# EAGLE design motor (EAGLE 9.6.2)

## Sheet 1 of 2: MOTOR_DRIVER
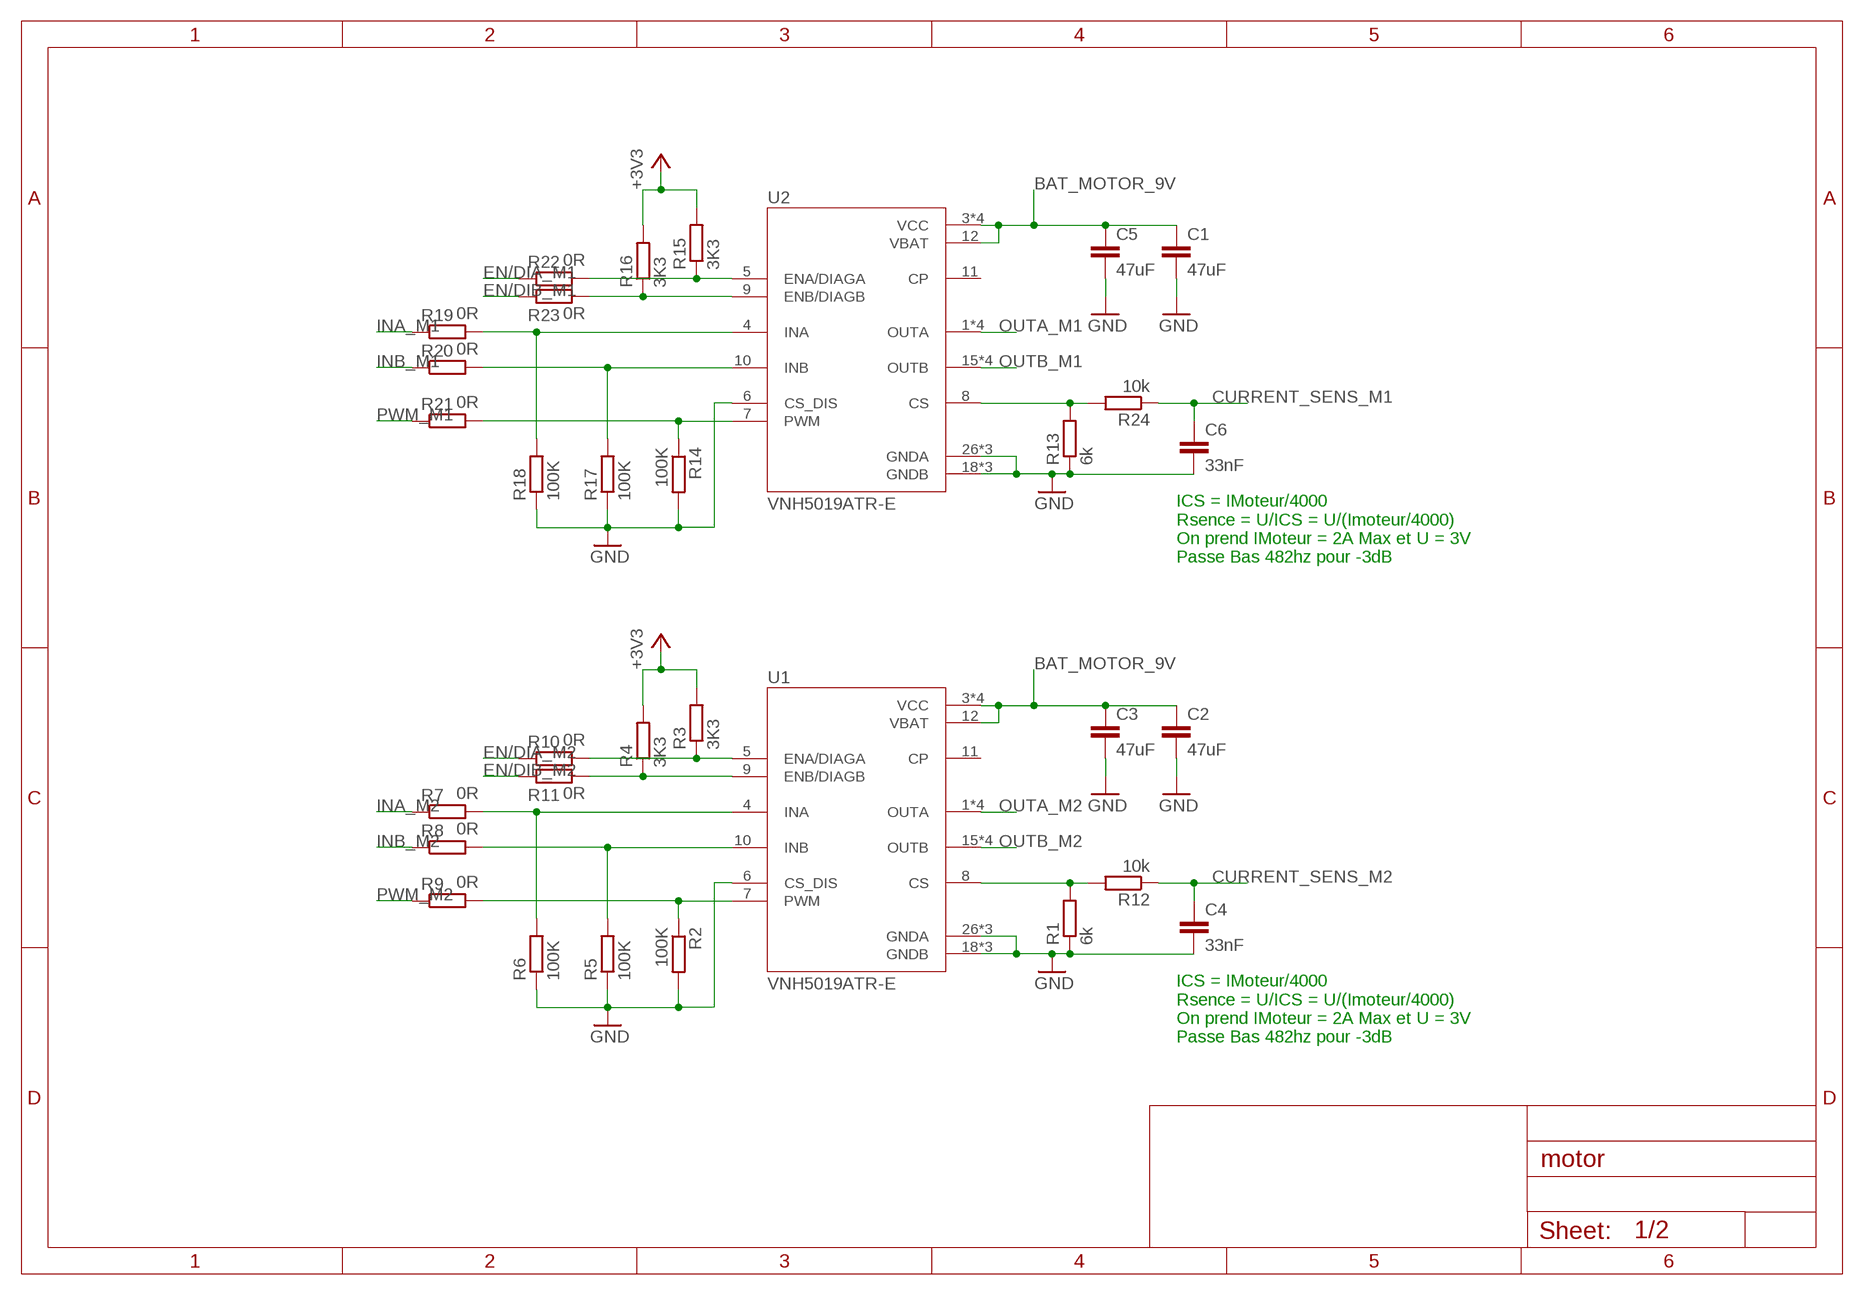
[diagram p0: schematic, sheet 1]

### Parts
C1  47uF  C-EUC0805  [C0805]
C2  47uF  C-EUC0805  [C0805]
C3  47uF  C-EUC0805  [C0805]
C4  33nF  C-EUC0805  [C0805]
C5  47uF  C-EUC0805  [C0805]
C6  33nF  C-EUC0805  [C0805]
R1  6k  R-EU_R0603  [R0603]
R2  100K  R-EU_R0603  [R0603]
R3  3K3  R-EU_R0603  [R0603]
R4  3K3  R-EU_R0603  [R0603]
R5  100K  R-EU_R0603  [R0603]
R6  100K  R-EU_R0603  [R0603]
R7  0R  R-EU_R0603  [R0603]
R8  0R  R-EU_R0603  [R0603]
R9  0R  R-EU_R0603  [R0603]
R10  0R  R-EU_R0603  [R0603]
R11  0R  R-EU_R0603  [R0603]
R12  10k  R-EU_R0603  [R0603]
R13  6k  R-EU_R0603  [R0603]
R14  100K  R-EU_R0603  [R0603]
R15  3K3  R-EU_R0603  [R0603]
R16  3K3  R-EU_R0603  [R0603]
R17  100K  R-EU_R0603  [R0603]
R18  100K  R-EU_R0603  [R0603]
R19  0R  R-EU_R0603  [R0603]
R20  0R  R-EU_R0603  [R0603]
R21  0R  R-EU_R0603  [R0603]
R22  0R  R-EU_R0603  [R0603]
R23  0R  R-EU_R0603  [R0603]
R24  10k  R-EU_R0603  [R0603]
U1  VNH5019ATR-E  [IC_VNH5019ATR-E]
U2  VNH5019ATR-E  [IC_VNH5019ATR-E]

### Nets
+3V3 [Power]: R3.2 R4.2 R15.2 R16.2 ; also sheet 2
BAT_MOTOR_9V [Motor]: C1.1 C2.1 C3.1 C5.1 U1.3(VCC) U1.12(VBAT) U1.13(VCC) U1.23(VCC) U1.HS1(VCC) U2.3(VCC) U2.12(VBAT) U2.13(VCC) U2.23(VCC) U2.HS1(VCC) ; also sheet 2
CURRENT_SENS_M1: C6.1 R24.1 ; also sheet 2
CURRENT_SENS_M2: C4.1 R12.1 ; also sheet 2
EN/DIA_M1: R22.1 ; also sheet 2
EN/DIA_M2: R10.1 ; also sheet 2
EN/DIB_M1: R23.1 ; also sheet 2
EN/DIB_M2: R11.1 ; also sheet 2
GND: C1.2 C2.2 C3.2 C4.2 C5.2 C6.2 R1.1 R2.2 R5.1 R6.1 R13.1 R14.2 R17.1 R18.1 U1.6(CS_DIS) U1.18(GNDB) U1.19(GNDB) U1.20(GNDB) U1.26(GNDA) U1.27(GNDA) U1.28(GNDA) U2.6(CS_DIS) U2.18(GNDB) U2.19(GNDB) U2.20(GNDB) U2.26(GNDA) U2.27(GNDA) U2.28(GNDA) ; also sheet 2
INA_M1: R19.1 ; also sheet 2
INA_M2: R7.1 ; also sheet 2
INB_M1: R20.1 ; also sheet 2
INB_M2: R8.1 ; also sheet 2
N$23: R1.2 R12.2 U1.8(CS)
N$24: R3.1 R10.2 U1.5(ENA/DIAGA)
N$25: R4.1 R11.2 U1.9(ENB/DIAGB)
N$26: R2.1 R9.2 U1.7(PWM)
N$27: R5.2 R8.2 U1.10(INB)
N$28: R6.2 R7.2 U1.4(INA)
N$29: R13.2 R24.2 U2.8(CS)
N$30: R15.1 R22.2 U2.5(ENA/DIAGA)
N$31: R16.1 R23.2 U2.9(ENB/DIAGB)
N$32: R14.1 R21.2 U2.7(PWM)
N$33: R17.2 R20.2 U2.10(INB)
N$34: R18.2 R19.2 U2.4(INA)
OUTA_M1 [Motor]: U2.1(OUTA) U2.25(OUTA) U2.30(OUTA) U2.HS2(OUTA) ; also sheet 2
OUTA_M2 [Motor]: U1.1(OUTA) U1.25(OUTA) U1.30(OUTA) U1.HS2(OUTA) ; also sheet 2
OUTB_M1 [Motor]: U2.15(OUTB) U2.16(OUTB) U2.21(OUTB) U2.HS3(OUTB) ; also sheet 2
OUTB_M2 [Motor]: U1.15(OUTB) U1.16(OUTB) U1.21(OUTB) U1.HS3(OUTB) ; also sheet 2
PWM_M1: R21.1 ; also sheet 2
PWM_M2: R9.1 ; also sheet 2
Unconnected: U1.11(CP) U2.11(CP)

### Notes on the sheet
- ICS = IMoteur/4000
  Rsence = U/ICS = U/(Imoteur/4000)
  On prend IMoteur = 2A Max et U = 3V
  Passe Bas 482hz pour -3dB
- ICS = IMoteur/4000
  Rsence = U/ICS = U/(Imoteur/4000)
  On prend IMoteur = 2A Max et U = 3V
  Passe Bas 482hz pour -3dB

## Sheet 2 of 2: MOTOR_CONNECTOR
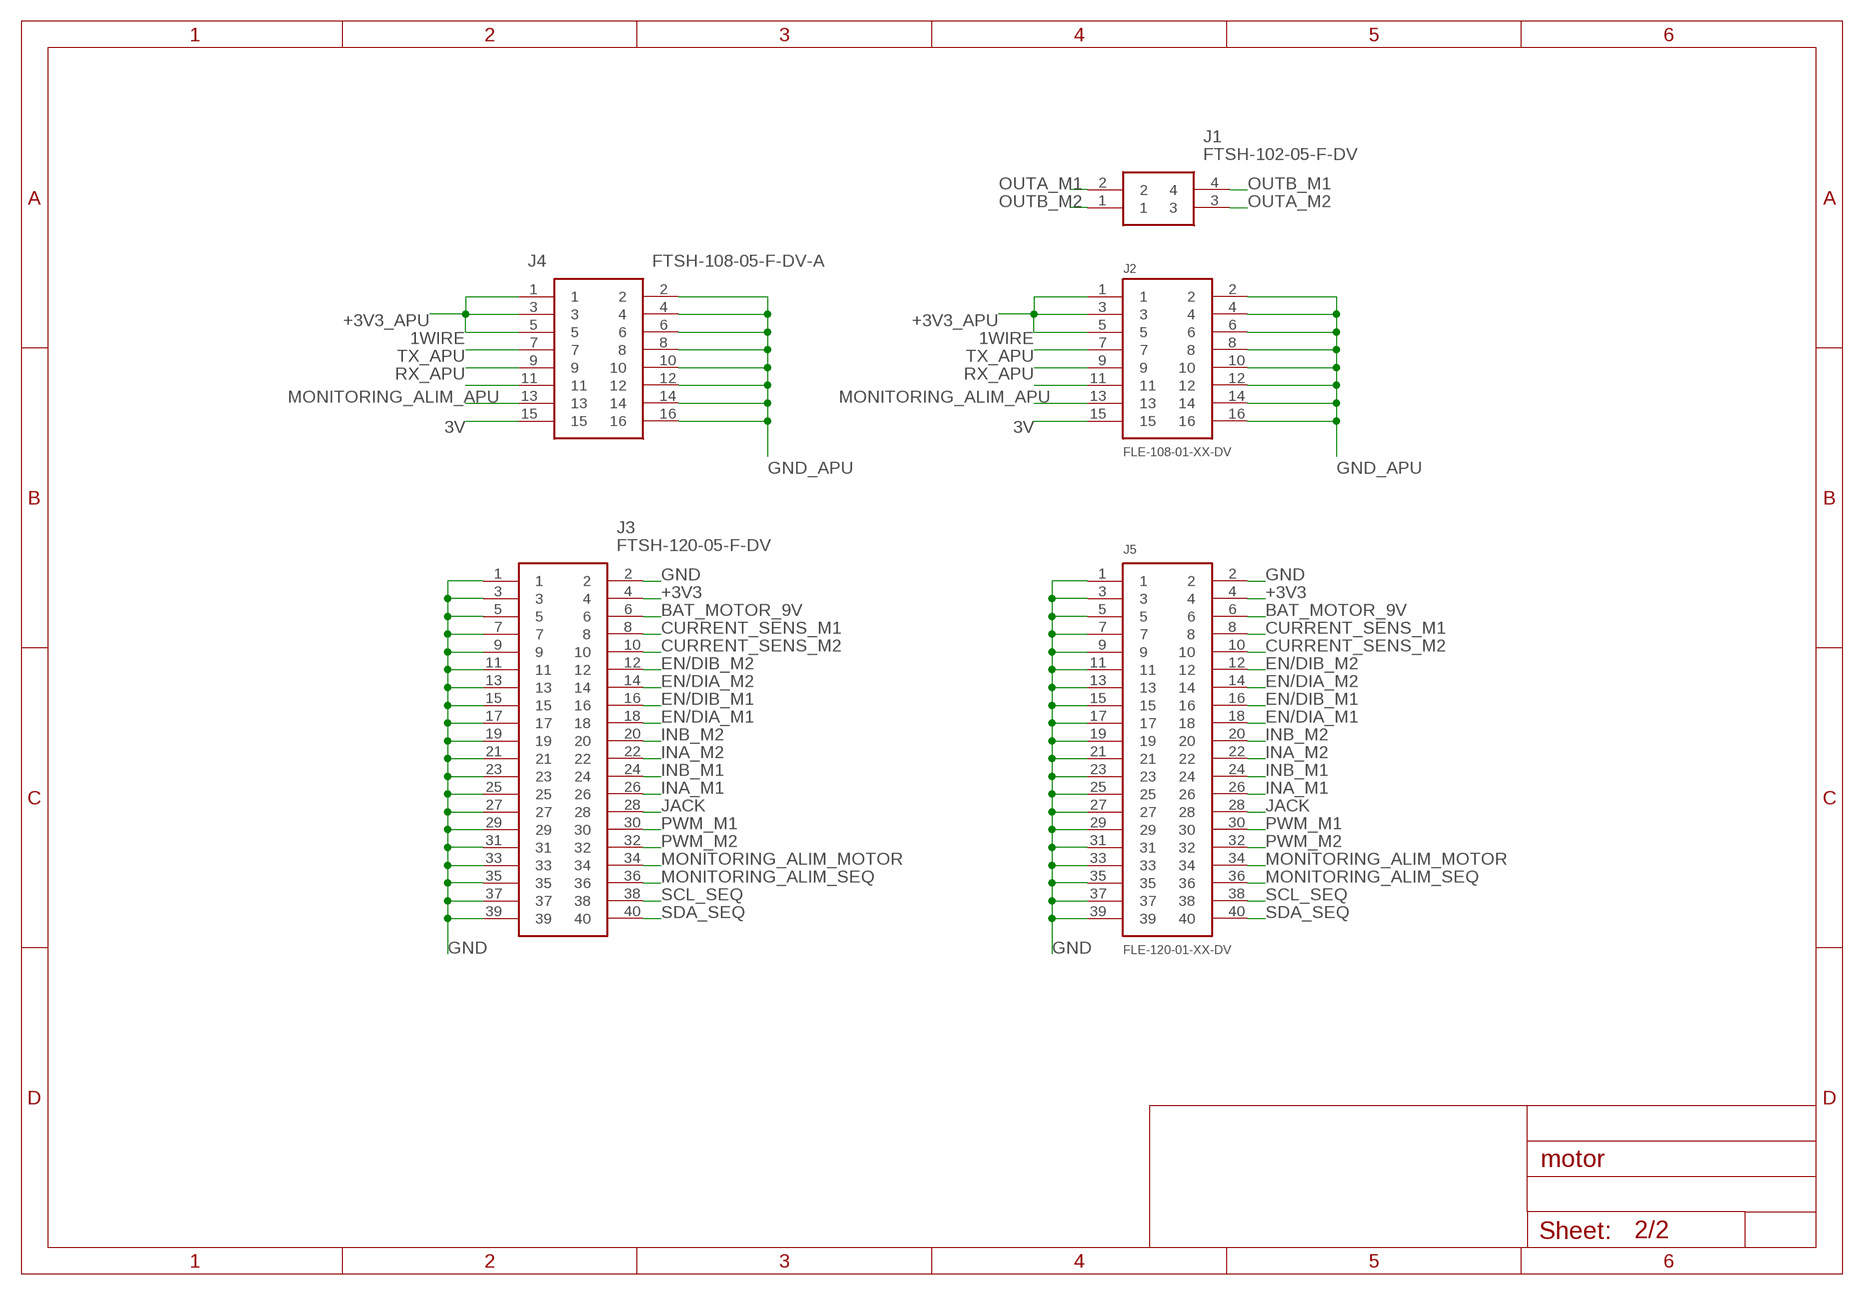
[diagram p1: schematic, sheet 2]

### Parts
J1  FTSH-102-05-F-DV  [FTSH-102-XX-YYY-DV]
J2  FLE-108-01-XX-DV  [FLE-108-01-XX-DV]
J3  FTSH-120-05-F-DV  [FTSH-120-XX-YYY-DV]
J4  FTSH-108-05-F-DV-A  [FTSH-108-XX-YYY-DV-A]
J5  FLE-120-01-XX-DV  [FLE-120-01-XX-DV]

### Nets
1WIRE [50Ohms]: J2.7 J4.7
3V [Power]: J2.15 J4.15
+3V3 [Power]: J3.4 J5.4 ; also sheet 1
+3V3_APU [Power]: J2.1 J2.3 J2.5 J4.1 J4.3 J4.5
BAT_MOTOR_9V [Motor]: J3.6 J5.6 ; also sheet 1
CURRENT_SENS_M1: J3.8 J5.8 ; also sheet 1
CURRENT_SENS_M2: J3.10 J5.10 ; also sheet 1
EN/DIA_M1: J3.18 J5.18 ; also sheet 1
EN/DIA_M2: J3.14 J5.14 ; also sheet 1
EN/DIB_M1: J3.16 J5.16 ; also sheet 1
EN/DIB_M2: J3.12 J5.12 ; also sheet 1
GND: J3.1 J3.2 J3.3 J3.5 J3.7 J3.9 J3.11 J3.13 J3.15 J3.17 J3.19 J3.21 J3.23 J3.25 J3.27 J3.29 J3.31 J3.33 J3.35 J3.37 J3.39 J5.1 J5.2 J5.3 J5.5 J5.7 J5.9 J5.11 J5.13 J5.15 J5.17 J5.19 J5.21 J5.23 J5.25 J5.27 J5.29 J5.31 J5.33 J5.35 J5.37 J5.39 ; also sheet 1
GND_APU: J2.2 J2.4 J2.6 J2.8 J2.10 J2.12 J2.14 J2.16 J4.2 J4.4 J4.6 J4.8 J4.10 J4.12 J4.14 J4.16
INA_M1: J3.26 J5.26 ; also sheet 1
INA_M2: J3.22 J5.22 ; also sheet 1
INB_M1: J3.24 J5.24 ; also sheet 1
INB_M2: J3.20 J5.20 ; also sheet 1
JACK: J3.28 J5.28
MONITORING_ALIM_APU: J2.13 J4.13
MONITORING_ALIM_MOTOR: J3.34 J5.34
MONITORING_ALIM_SEQ: J3.36 J5.36
OUTA_M1 [Motor]: J1.2 ; also sheet 1
OUTA_M2 [Motor]: J1.3 ; also sheet 1
OUTB_M1 [Motor]: J1.4 ; also sheet 1
OUTB_M2 [Motor]: J1.1 ; also sheet 1
PWM_M1: J3.30 J5.30 ; also sheet 1
PWM_M2: J3.32 J5.32 ; also sheet 1
RX_APU [50Ohms]: J2.11 J4.11
SCL_SEQ [50Ohms]: J3.38 J5.38
SDA_SEQ [50Ohms]: J3.40 J5.40
TX_APU [50Ohms]: J2.9 J4.9

## Library data of the parts
C1-C6 = rcl:C-EU: CAPACITOR, European symbol; SPICEPREFIX: C
J1 = FTSH-102-05-F-DV:FTSH-102-05-F-DV: 4 Position, High Reliability Header Strips, 0.050" pitch Source: Datasheet <http://suddendocs.samtec.com/prints/ftsh-1xx-xx-xxx-dv-xxx-xxx-mkt.pdf>; DESCRIPTION: 4 Position, High Reliability Header Strips, 0.050&quot; pitch; HEIGHT: mm; MANUFACTURER_NAME: SAMTEC; MANUFACTURER_PART_NUMBER: FTSH-102-05-F-DV
J2 = FLE-108-01-XX-DV:FLE-108-01-XX-DV: DOUBLE ROW 0.050"X0.050" STRIP ASSEMBLY. Check prices <https://pricing.snapeda.com/parts/FLE-108-01-G-DV/Samtec/view-part?ref=eda>; AVAILABILITY: Bad; DESCRIPTION: 16 Position Receptacle Connector Surface Mount; MF: Samtec; MP: FLE-108-01-G-DV; PACKAGE: None; PRICE: None; PURCHASE-URL: https://pricing.snapeda.com/search/part/FLE-108-01-G-DV/?ref=eda
J3 = FTSH-120-05-F-DV:FTSH-120-05-F-DV: 40 Position, High Reliability Header Strips, 0.050" pitch Source: Datasheet <http://suddendocs.samtec.com/prints/ftsh-1xx-xx-xxx-dv-xxx-xxx-mkt.pdf>; DESCRIPTION: 40 Position, High Reliability Header Strips, 0.050&quot; pitch; HEIGHT: mm; MANUFACTURER_NAME: SAMTEC; MANUFACTURER_PART_NUMBER: FTSH-120-05-F-DV
J4 = FTSH-108-05-F-DV-A:FTSH-108-05-F-DV-A: 16 Position, High Reliability Header Strips, 0.050" pitch Source: Datasheet <http://suddendocs.samtec.com/prints/ftsh-1xx-xx-xxx-dv-xxx-xxx-mkt.pdf>; ARROW_PART_NUMBER: FTSH-108-05-F-DV-A; ARROW_PRICE-STOCK: https://www.arrow.com/en/products/ftsh-108-05-f-dv-a/samtec; DESCRIPTION: 16 Position, High Reliability Header Strips, 0.050&quot; pitch; HEIGHT: mm; MANUFACTURER_NAME: SAMTEC; MANUFACTURER_PART_NUMBER: FTSH-108-05-F-DV-A; MOUSER_PART_NUMBER: 200-FTSH10805FDVA; MOUSER_PRICE-STOCK: https://www.mouser.co.uk/ProductDetail/Samtec/FTSH-108-05-F-DV-A?qs=PB6%2FjmICvI1admAR1gVHNg%3D%3D
J5 = FLE-120-01-XX-DV:FLE-120-01-XX-DV: DOUBLE ROW 0.050"X0.050" STRIP ASSEMBLY. Check prices <https://pricing.snapeda.com/parts/FLE-120-01-G-DV/Samtec/view-part?ref=eda>; AVAILABILITY: Bad; DESCRIPTION: 40 Position Receptacle Connector Surface Mount; MF: Samtec; MP: FLE-120-01-G-DV; PACKAGE: None; PRICE: None; PURCHASE-URL: https://pricing.snapeda.com/search/part/FLE-120-01-G-DV/?ref=eda
R1-R24 = rcl:R-EU_: RESISTOR, European symbol; SPICEPREFIX: R
U1 U2 = VNH5019ATR-E:VNH5019ATR-E: Motor / Motion / Ignition Controllers & Drivers Automotive h-Bridge 18mohm 30a 41v Vcc Check prices <https://pricing.snapeda.com/parts/VNH5019ATR-E/STMicroelectronics/view-part?ref=eda>; AVAILABILITY: Good; DESCRIPTION: Motor Driver Power MOSFET Parallel, PWM MultiPowerSO-30; MF: STMicroelectronics; MP: VNH5019ATR-E; PACKAGE: SOP-30 STMicroelectronics; PRICE: None; PURCHASE-URL: https://pricing.snapeda.com/search/part/VNH5019ATR-E/?ref=eda

## Net classes
0 default: width 0.2 mm, clearance 0.127 mm
1 Power: width 0.4 mm, clearance 0.2 mm
2 50Ohms: width 0.147 mm, clearance 0.127 mm
3 Motor: width 0.4 mm, clearance 0.5 mm

## Board
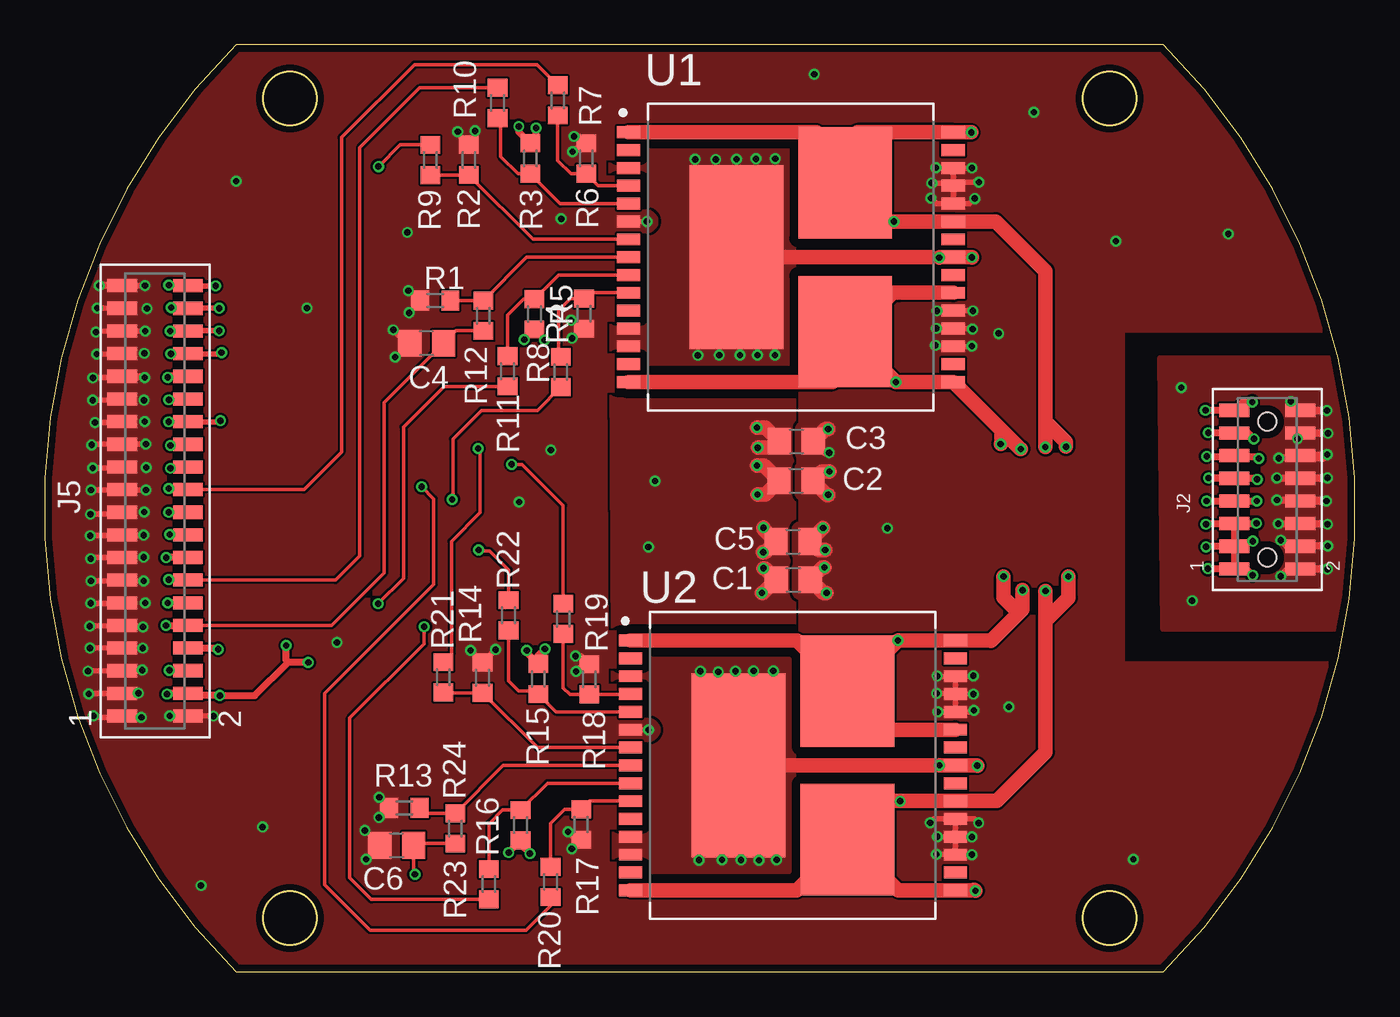
[diagram p2: board, top side]
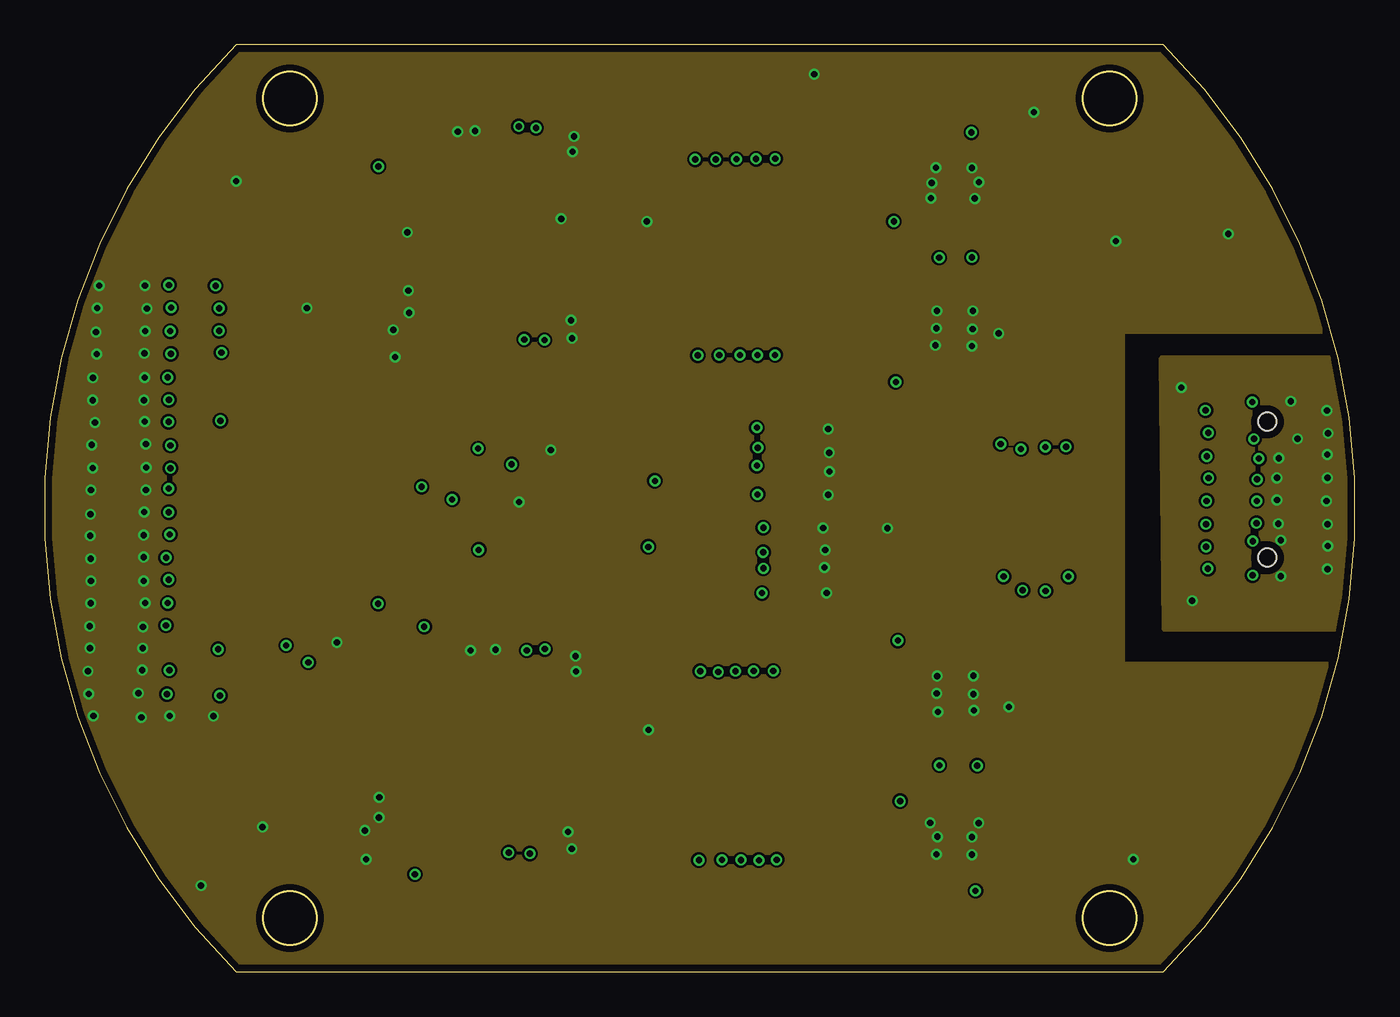
[diagram p3: board, inner layer Route2]
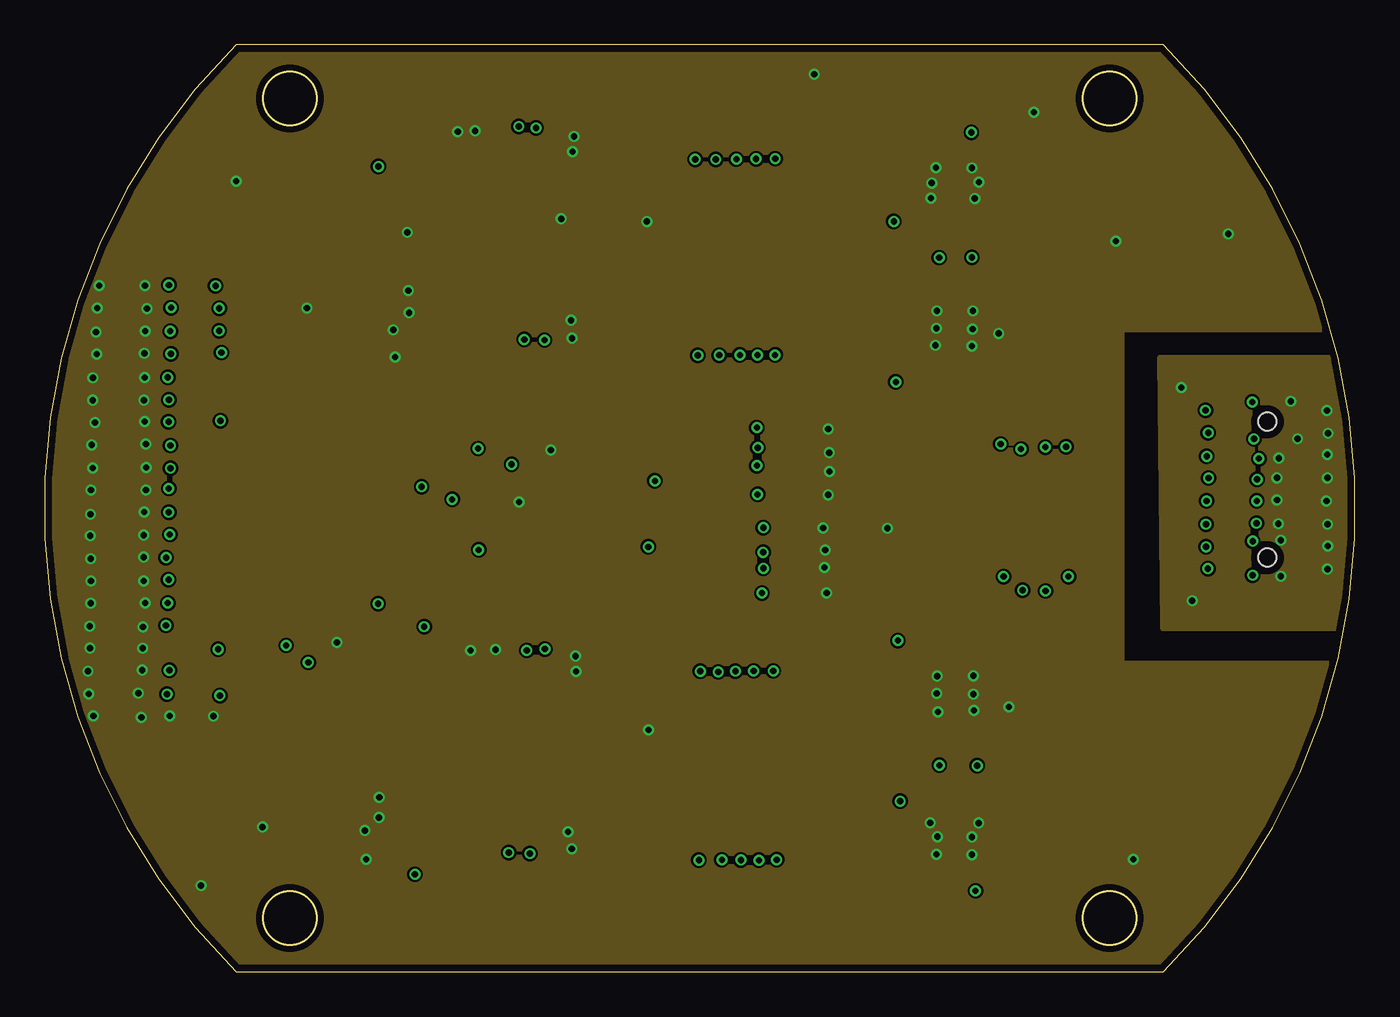
[diagram p4: board, inner layer Route15]
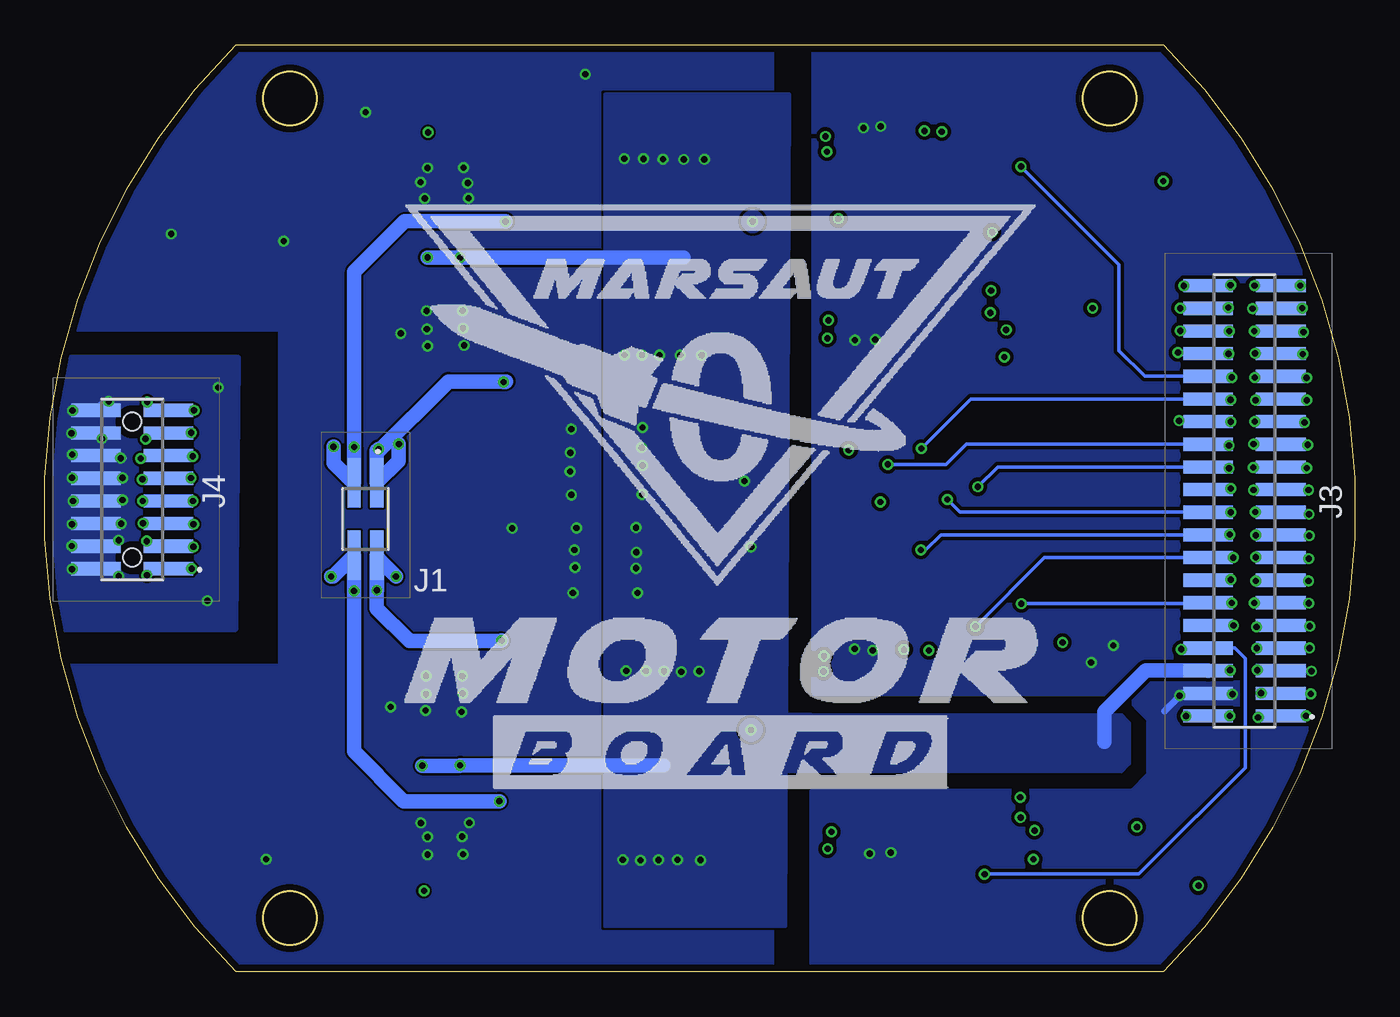
[diagram p5: board, bottom side, seen from below]

Size 73.46 x 52 mm. Coordinates in mm from the lower left corner, seen from the top.
Outline: 10.73,0 62.73,0 arc90 62.73,52 10.73,52 arc90 10.73,0
Outline: circle at 13.75,3.02 radius 1.5
Outline: circle at 59.71,48.98 radius 1.5
Outline: circle at 13.75,48.98 radius 1.5
Outline: circle at 59.71,3.02 radius 1.5
Copper layers (1+2*15+16): Top 0.035mm / dielectric 0.1mm / Route2 0.0175mm / dielectric 1.265mm / Route15 0.0175mm / dielectric 0.1mm / Bottom 0.035mm
Design rules "Marsaut0": minimum track width 3.5mil, minimum drill 0.2mm, track to track 4mil, track to pad 0.2mm, pad to pad 5mil, via to via 0.5mm, smd to smd 5mil, copper to edge 0.4mm, drill to drill 0.5mm, minimum pad ring 0.3mm, minimum via ring 0.13mm, stop-mask expansion 4mil, vias tented up to drill 0mil, thermal gap 10mil

### Footprints (pad centres in the part's own frame; a part is rotated, then mirrored left to right if it is on the bottom)
C0805 = smd 1.3 x 1.5: 1 -0.95,0; 2 0.95,0
FTSH-102-XX-YYY-DV = smd 0.74 x 2.79: 1 -0.635,-2.035; 2 -0.635,2.035; 3 0.635,-2.035; 4 0.635,2.035
FLE-108-01-XX-DV = smd 0.737 x 1.676: 1 -4.445,1.841; 2 -4.445,-1.841; 3 -3.175,1.841; 4 -3.175,-1.841; 5 -1.905,1.841; 6 -1.905,-1.841; 7 -0.635,1.841; 8 -0.635,-1.841; 9 0.635,1.841; 10 0.635,-1.841; 11 1.905,1.841; 12 1.905,-1.841; 13 3.175,1.841; 14 3.175,-1.841; 15 4.445,1.841; 16 4.445,-1.841
FTSH-120-XX-YYY-DV = smd 0.74 x 2.79: 1 -12.065,-2.035; 2 -12.065,2.035; 3 -10.795,-2.035; 4 -10.795,2.035; 5 -9.525,-2.035; 6 -9.525,2.035; 7 -8.255,-2.035; 8 -8.255,2.035; 9 -6.985,-2.035; 10 -6.985,2.035; 11 -5.715,-2.035; 12 -5.715,2.035; 13 -4.445,-2.035; 14 -4.445,2.035; 15 -3.175,-2.035; 16 -3.175,2.035; 17 -1.905,-2.035; 18 -1.905,2.035; 19 -0.635,-2.035; 20 -0.635,2.035; 21 0.635,-2.035; 22 0.635,2.035; 23 1.905,-2.035; 24 1.905,2.035; 25 3.175,-2.035; 26 3.175,2.035; 27 4.445,-2.035; 28 4.445,2.035; 29 5.715,-2.035; 30 5.715,2.035; 31 6.985,-2.035; 32 6.985,2.035; 33 8.255,-2.035; 34 8.255,2.035; 35 9.525,-2.035; 36 9.525,2.035; 37 10.795,-2.035; 38 10.795,2.035; 39 12.065,-2.035; 40 12.065,2.035
FTSH-108-XX-YYY-DV-A = smd 0.74 x 2.79: 1 -4.445,-2.035; 2 -4.445,2.035; 3 -3.175,-2.035; 4 -3.175,2.035; 5 -1.905,-2.035; 6 -1.905,2.035; 7 -0.635,-2.035; 8 -0.635,2.035; 9 0.635,-2.035; 10 0.635,2.035; 11 1.905,-2.035; 12 1.905,2.035; 13 3.175,-2.035; 14 3.175,2.035; 15 4.445,-2.035; 16 4.445,2.035 | hole 1.02: -3.81,0; 3.81,0
FLE-120-01-XX-DV = smd 0.737 x 1.676: 1 -12.065,1.841; 2 -12.065,-1.841; 3 -10.795,1.841; 4 -10.795,-1.841; 5 -9.525,1.841; 6 -9.525,-1.841; 7 -8.255,1.841; 8 -8.255,-1.841; 9 -6.985,1.841; 10 -6.985,-1.841; 11 -5.715,1.841; 12 -5.715,-1.841; 13 -4.445,1.841; 14 -4.445,-1.841; 15 -3.175,1.841; 16 -3.175,-1.841; 17 -1.905,1.841; 18 -1.905,-1.841; 19 -0.635,1.841; 20 -0.635,-1.841; 21 0.635,1.841; 22 0.635,-1.841; 23 1.905,1.841; 24 1.905,-1.841; 25 3.175,1.841; 26 3.175,-1.841; 27 4.445,1.841; 28 4.445,-1.841; 29 5.715,1.841; 30 5.715,-1.841; 31 6.985,1.841; 32 6.985,-1.841; 33 8.255,1.841; 34 8.255,-1.841; 35 9.525,1.841; 36 9.525,-1.841; 37 10.795,1.841; 38 10.795,-1.841; 39 12.065,1.841; 40 12.065,-1.841
R0603 = smd 1 x 1.1: 1 -0.85,0; 2 0.85,0
IC_VNH5019ATR-E = smd 1.3 x 0.665: 1 -9.1,7; 2 -9.1,6; 3 -9.1,5; 4 -9.1,4; 5 -9.1,3; 6 -9.1,2; 7 -9.1,1; 8 -9.1,0; 9 -9.1,-1; 10 -9.1,-2; 11 -9.1,-3; 12 -9.1,-4; 13 -9.1,-5; 14 -9.1,-6; 15 -9.1,-7; 16 9.1,-7; 17 9.1,-6; 18 9.1,-5; 19 9.1,-4; 20 9.1,-3; 21 9.1,-2; 22 9.1,-1; 23 9.1,0; 24 9.1,1; 25 9.1,2; 26 9.1,3; 27 9.1,4; 28 9.1,5; 29 9.1,6; 30 9.1,7 | smd 5.25 x 10.3: HS1 -3.05,0 | smd 5.25 x 6.23: HS2 3.05,4.165; HS3 3.05,-4.165

### Placement (x,y rotation side)
C1  41.97,21.99 0 top
C2  42.12,27.54 0 top
C3  42.15,29.75 0 top
C4  21.42,35.25 180 top
C5  41.95,24.13 0 top
C6  19.74,7.09 180 top
J1  55.47,25.4 180 bottom
J2  68.55,27.05 90 top
J3  6.19,26.42 90 bottom
J4  68.55,27.05 90 bottom
J5  6.19,26.42 90 top
R1  21.9,37.65 0 top
R2  23.78,45.54 90 top
R3  27.23,45.61 90 top
R4  27.46,36.89 270 top
R5  30.24,36.91 90 top
R6  30.36,45.61 270 top
R7  28.77,48.88 270 top
R8  28.94,33.64 90 top
R9  21.63,45.52 270 top
R10  25.39,48.72 270 top
R11  25.96,33.68 90 top
R12  24.6,36.8 90 top
R13  20.17,9.21 0 top
R14  24.55,16.51 90 top
R15  27.67,16.43 90 top
R16  26.68,8.23 270 top
R17  30.08,8.28 90 top
R18  30.54,16.41 270 top
R19  29.08,19.8 270 top
R20  28.37,5.05 90 top
R21  22.36,16.52 270 top
R22  26.01,20 270 top
R23  24.91,4.92 90 top
R24  23.03,8.05 90 top
U1  41.84,40.08 0 top
U2  41.96,11.58 0 top

### Tracks (layer width: path | path; a pad name or v marks a point on that pad's centre or on a via)
1WIRE  (via drill 0.35)
  Top 0.4: J2.7 v65.15,26.41 v67.96,26.41
  Bottom 0.4: J4.7 v65.15,26.42 v65.15,26.41 v67.96,26.41
3V  (via drill 0.35)
  Top 0.4: v65.08,31.49 J2.15 67.19,31.97 67.71,31.97 v67.71,31.96
  Bottom 0.4: J4.15 65.09,31.5 65.09,31.49 | 65.09,31.49 v65.08,31.49 | v67.71,31.96 67.24,31.49 65.09,31.49
+3V3  (via drill 0.35)
  Top 0.4: v26.59,47.41 26.59,47.1 R3.2 27.55,46.79 v27.55,47.33 | v27.03,18.03 27.03,17.93 R15.2 27.67,17.74 v28.05,18.11 | J5.4 6.9,15.62 v6.86,15.58 | v6.86,15.58 | 8.73,15.52 9.81,15.52 v9.83,15.5 11.78,15.5 13.64,17.36 | v26.02,6.7 26.03,6.7 26.03,6.73 R16.2 26.68,7.17 v27.21,6.64 | v27.21,6.64 | v26.89,35.46 R4.2 28.03,35.47 v28.03,35.43 | v14.78,17.36 13.64,17.36 | 13.64,17.36 13.54,17.45 v13.54,18.31
  Bottom 0.4: v6.86,15.58 8.18,15.58 J3.4 | J3.4 9.7,15.62 v9.83,15.5 | J3.4 9.68,15.62 10.67,14.63
  pour Bottom (no thermals): 30.3,15.67 12.99,15.67 11.52,14.2 11.52,11.04 12.49,10.08 30.42,10.08 30.42,-0.85 30.9,-1.33 8.49,-1.33 -6.95,14.1 -6.95,53.83 -7.02,53.91 30.3,53.91
+3V3_APU  (via drill 0.35)
  Top 0.4: J2.3 J2.5 66.67,25.11 v65.11,25.11 67.88,25.11 v67.94,25.16 | J2.3 J2.1 65.24,22.61 v65.23,22.62 v65.22,22.62 67.34,22.62 v67.72,22.24 v67.73,22.25 | v65.12,23.84 65.16,23.88 J2.3
  Bottom 0.4: J4.1 v65.22,22.62 67.36,22.62 v67.73,22.25 | J4.5 67.92,25.15 v67.94,25.16 | J4.3 67.45,23.88 v67.73,24.16 67.41,23.84 v65.12,23.84
BAT_MOTOR_9V  (via drill 0.35)
  Top 0.4: v7,16.92 8.01,16.92 J5.6
  Top 0.813: v40.22,21.25 40.28,21.25 C1.1 40.38,22.63 v40.3,22.63 | v40.28,23.53 40.28,23.54 40.41,23.54 C5.1 40.3,24.84 v40.3,24.91 | v50.16,40.05 50.18,40.08 U1.23 51.98,40.08 v51.99,40.07 | v50.17,11.59 U2.23 52.27,11.59 v52.29,11.56 | U2.HS1 49.79,11.59 | U1.HS1 49.67,40.08 | v39.93,28.39 40.32,28.39 C2.1 40.41,26.78 v39.97,26.78 | v39.98,29.4 40.84,29.4 C3.1 40.43,30.52 v39.93,30.52
  Bottom 0.4: J3.6 7.02,16.89 v7,16.92
  Bottom 0.813: J3.6 11.73,16.9 14.06,14.58 14.06,12.91 | 37.64,40.05 v50.16,40.05 50.17,40.07 v51.99,40.07 | 38.75,11.59 v50.17,11.59 50.19,11.56 v52.29,11.56
  other vias: 40.95,34.59 39.97,34.58 38.98,34.59 37.82,34.58 36.62,34.57 36.47,45.57 37.63,45.56 38.78,45.57 39.89,45.59 40.96,45.61 34.22,27.54 33.85,23.84 37.76,16.83 36.76,16.86 40.85,16.88 38.73,16.87 39.75,16.88 36.68,6.27 37.97,6.29 39.04,6.28 40.05,6.27 41.04,6.29
  pour Top (no thermals): 31.92,2.55 42.04,2.55 42.04,49.21 31.69,49.21
  pour Bottom (isolate 0.254, rank 2, no thermals): 30.7,14.42 13.08,14.42 12.66,14 12.66,11.67 12.7,11.63 13.08,11.25 13.17,11.25 32.38,11.25 32.76,11.63 32.76,13.78 32.74,13.79 32.1,14.43 30.51,14.43
  pour Bottom (no thermals): 31.93,2.56 42.05,2.56 42.05,49.21 31.69,49.21
CURRENT_SENS_M1  (via drill 0.35)
  Top 0.2: R24.1 20.8,7.2 C6.1 20.69,5.55 v20.76,5.48
  Top 0.4: J5.8 9.66,18.16 v9.73,18.09
  Bottom 0.2: v20.76,5.48 20.73,5.51 12.1,5.51 8.88,8.74 8.85,8.74 6.14,11.45 6.14,17.58 6.72,18.16 J3.8
  Bottom 0.4: v9.73,18.09 8.3,18.09 J3.8
CURRENT_SENS_M2  (via drill 0.35)
  Top 0.2: R12.1 23.08,35.95 C4.1 19.04,31.92 19.04,22.38 16.09,19.43 J5.10
  Top 0.4: v6.8,19.43 J5.10
  Bottom 0.4: J3.10 v6.8,19.43
EN/DIA_M1  (via drill 0.35)
  Top 0.2: R22.1 26.01,22.55 24.96,23.6 24.34,23.6 v24.34,23.67
  Top 0.4: v7.02,24.53 7.03,24.51 J5.18
  Bottom 0.2: v24.34,23.67 24.07,23.67 23.22,24.51 J3.18
  Bottom 0.4: J3.18 7.08,24.51 7.04,24.55 v7.02,24.53
EN/DIA_M2  (via drill 0.35)
  Top 0.2: R10.1 21.04,49.57 17.67,46.21 17.67,23.33 16.31,21.97 J5.14
  Top 0.4: v6.95,22 8,22 J5.14
  Bottom 0.4: J3.14 6.97,21.97 v6.95,21.99 v6.95,22
EN/DIB_M1  (via drill 0.35)
  Top 0.2: R23.1 18.32,4.07 17.11,5.28 17.11,14.24 21.28,18.41 v21.28,19.36
  Top 0.4: J5.16 v6.81,23.23
  Bottom 0.2: v21.28,19.36 17.4,23.24 J3.16
  Bottom 0.4: v6.81,23.23 J3.16
EN/DIB_M2  (via drill 0.35)
  Top 0.2: R11.1 22.4,32.84 20.12,30.56 20.12,22.08 v18.7,20.65
  Top 0.4: J5.12 8.02,20.69 v6.9,20.69
  Bottom 0.2: v18.7,20.65 8.28,20.65 J3.12
  Bottom 0.4: v6.9,20.69 8.21,20.69 J3.12
GND  (via drill 0.35)
  Top 0.2: U1.20 50.98,37.12 | U1.27 50.97,44.05 | U1.28 50.95,45.07 | U2.26 51.11,14.64
  Top 0.305: v18.03,6.32 v18.03,6.33 C6.2 v17.96,7.93 | v18.75,8.66 18.78,8.66 R13.1 18.76,9.76 v18.76,9.79 | v29.56,6.91 R17.1 29.77,7.43 v29.34,7.85 v29.34,7.86 | v23.89,18.03 v23.89,18.02 R14.2 v25.27,18.08 v25.28,18.08 | v29.77,17.71 30.08,17.71 R18.1 30.37,17.43 | 30.37,17.43 | 30.37,17.43 v29.8,16.85 v29.79,16.85 | v29.79,16.85 | v19.65,34.47 19.7,34.47 C4.2 20.31,35.25 v19.55,36.01 | v20.44,36.96 20.44,36.97 21.05,37.58 R1.1 20.95,37.65 v20.39,38.2 | v29.57,35.53 29.72,35.53 R5.1 29.76,36.54 v29.52,36.54 | v23.16,47.12 23.16,47.01 R2.2 24.17,46.77 24.17,47.15 24.16,47.16 v24.14,47.16 | v29.68,46.85 29.97,46.85 R6.1 30.07,46.46 v29.6,45.98 v29.6,45.99 | U1.6 v33.76,42.08 | U2.6 33.85,13.59 v33.86,13.57 | U1.28 U1.27 | U1.27 U1.26 | U1.27 50.78,44.24 v49.74,44.24 | U1.28 49.99,45.08 v49.97,45.1 | U1.26 49.99,43.08 v49.68,43.39 | v50.03,37.07 50.04,37.08 U1.20 52.02,37.08 52.03,37.09 v52.05,37.07 | v50,36.09 v50.01,36.08 U1.19 52,36.08 52.02,36.05 v52.02,36.05 | v49.95,35.14 50.01,35.08 U1.18 51.97,35.08 v51.99,35.09 | U2.28 U2.27 | U2.27 U2.26 | U2.26 51.05,14.58 v50.09,14.58 | U2.27 51.02,15.62 v50.01,15.62 | U2.28 v50.05,16.59 v50.04,16.59 | U2.20 49.87,8.59 v49.65,8.36 | U2.19 v50.06,7.58 v50.05,7.59 | U2.18 50.02,6.58 v50,6.6 | U2.18 U2.19 | U2.19 U2.20 | J5.39 v5.63,38.48 | J5.35 5.63,35.94 v5.64,35.93 2.94,35.93 v2.88,35.88 | J5.31 5.55,33.4 v5.62,33.33 5.61,33.32 v2.71,33.32 | J5.25 v5.68,29.6 2.68,29.6 v2.64,29.56 | J5.21 4.38,27.02 v5.68,27.02 v5.68,27.03 v2.6,27.03 | J5.17 4.37,24.5 v5.55,24.5 5.52,24.46 v2.56,24.46 | J5.13 4.4,21.93 v5.56,21.93 v5.56,21.92 v2.6,21.92 | J5.9 4.43,19.35 v5.51,19.35 5.47,19.39 v2.53,19.39
  Top 0.305: J5.5 5.44,16.89 v5.48,16.93 5.42,16.87 v2.43,16.87 | J5.1 4.43,14.28 v5.42,14.28 2.81,14.28 v2.74,14.36 | J5.2 v7.02,14.35 v7.01,14.36 7.02,14.35 v9.47,14.35 | U1.27 50.97,44.04 51.3,44.04 51.54,44.28 v52.38,44.28 | U1.28 51.98,45.08 v51.98,45.08 v51.99,45.08 | v52.15,43.37 51.86,43.08 U1.26 | U2.28 52.06,16.59 v52.08,16.6 v52.07,16.61 | U2.27 v52.07,15.58 | U2.26 52.03,14.59 v52.1,14.65 v52.1,14.66 | U2.18 v51.99,6.58 v52,6.58 | U2.18 v51.98,6.58 v51.99,6.58 | U2.19 51.97,7.58 v51.98,7.57 | U2.20 52.14,8.59 v52.37,8.36 | J5.37 2.94,37.21 v2.95,37.23 | J5.33 4.32,34.64 v2.93,34.64 | J5.29 4.28,32.06 v2.69,32.06 | J5.27 4.29,30.8 v2.82,30.8 | J5.23 4.28,28.25 2.7,28.25 v2.7,28.26 | J5.19 4.24,25.67 v2.57,25.67 | J5.15 2.65,23.24 v2.58,23.18 v2.59,23.17 | v2.59,23.17 | J5.11 4.33,20.68 v2.58,20.68 | J5.7 v2.54,18.16 | v2.54,18.16 | J5.3 2.51,15.62 v2.48,15.59 | v2.48,15.59
  Top 0.4: C3.2 43.73,29.12 v43.99,29.12 | J5.39 v3.07,38.48
  Top 0.813: v43.84,21.25 43.66,21.25 C1.2 43.62,22.68 v43.73,22.68 | v43.94,26.75 43.86,26.75 C2.2 43.59,28.06 v44,28.06 | C3.2 43.77,30.43 43.94,30.43 v43.94,30.45 | v43.77,23.66 43.38,23.66 C5.2 42.9,24.14 v43.65,24.89
  Bottom 0.305: v5.63,38.48 4.55,38.48 J3.39 v3.07,38.48 | J3.37 5.72,37.21 v5.74,37.19 5.7,37.23 v2.95,37.23 | J3.33 5.58,34.67 v5.59,34.69 2.97,34.69 v2.93,34.64 | J3.29 5.5,32.13 v5.57,32.06 v2.69,32.06 | J3.27 v5.61,30.86 2.88,30.86 v2.82,30.8 | J3.23 4.2,28.28 v5.7,28.28 2.73,28.28 v2.7,28.26 | J3.19 4.17,25.79 v5.59,25.79 5.46,25.67 v2.57,25.67 | J3.15 4.18,23.26 v5.55,23.26 2.68,23.26 v2.59,23.17 | J3.11 v5.64,20.7 5.62,20.68 v2.58,20.68 | J3.7 v5.49,18.16 5.49,18.16 v2.54,18.16 | J3.3 5.25,15.62 v5.26,15.63 5.22,15.59 v2.48,15.59 | J3.35 4.09,35.88 v2.88,35.88 | J3.31 4.08,33.32 v2.71,33.32 | J3.25 4.11,29.54 2.64,29.54 v2.64,29.56 | J3.21 4.14,27.03 v2.6,27.03 | J3.17 4.08,24.43 2.56,24.43 v2.56,24.46 | J3.13 4.09,21.91 2.6,21.91 v2.6,21.92 | J3.9 4.11,19.38 2.53,19.38 v2.53,19.39 | J3.5 2.47,16.89 v2.44,16.86 v2.43,16.87 | J3.1 2.65,14.35 2.59,14.3 2.68,14.3 v2.74,14.36 | J3.2 v9.46,14.35 v9.47,14.35
  Bottom 0.4: v3.07,38.48 4.55,38.48
  other vias: 10.74,44.34 28.38,29.26 16.39,18.47 26.6,26.36 12.22,8.13 8.77,4.85 14.71,37.23 20.34,41.47 28.96,42.23 47.25,24.88 54.06,14.86 61.04,6.32 60.05,40.98 53.49,35.8 66.37,41.39 55.46,48.2 43.15,50.34
  pour Route15 (rank 2, no thermals): 60.34,36.03 60.34,17.31 75.81,17.27 75.95,17.14 75.95,-3.51 -4.61,-3.51 -4.61,58.18 -4.49,58.3 76.52,58.3 76.88,58.66 76.05,36.04 76.07,36.04
  pour Route2 (rank 2, no thermals): 60.37,35.96 60.37,17.24 75.83,17.2 75.97,17.07 75.97,-3.58 -4.59,-3.58 -4.59,58.11 -4.47,58.23 76.54,58.23 76.9,58.59 76.07,35.98 76.09,35.98
  pour Top (rank 2, no thermals): 60.37,36.01 60.37,17.28 75.83,17.25 75.97,17.11 75.97,-3.53 -4.59,-3.53 -4.59,58.15 -4.47,58.27 76.54,58.27 76.9,58.64 76.07,36.02 76.09,36.02
  pour Bottom (rank 2, no thermals): 32.62,53.77 32.74,53.89 75.53,53.89 75.65,53.77 75.65,36 75.69,35.96 60.35,35.96 60.31,36 60.31,17.29 60.39,17.21 75.93,17.21 75.95,17.19 75.95,-3.47 76.09,-3.61 32.65,-3.61 32.63,-3.62
GND_APU  (via drill 0.35)
  Top 0.4: J2.2 70.41,22.59 v71.92,22.59 69.7,22.59 v69.3,22.19 | 71.94,23.88 J2.4 69.63,23.88 v69.3,24.21 | J2.6 70.43,25.11 v71.93,25.11 69.2,25.11 v69.17,25.14 | J2.8 v71.86,26.42 v71.86,26.41 71.81,26.47 v69.09,26.47 | J2.10 71.9,27.69 v71.92,27.71 v69.09,27.71 | J2.12 71.86,28.96 v71.91,29 | v71.91,29 | v71.91,29 v71.91,29.01 71.71,28.81 v69.19,28.81 | J2.14 70.41,30.21 v71.96,30.21 70.55,30.21 v70.24,29.9 | J2.16 v71.88,31.5 v71.89,31.48 70.38,31.48 v69.86,32
  Bottom 0.4: J4.4 71.94,23.88 v71.95,23.89 69.48,23.89 69.23,24.13 v69.3,24.21 | J4.6 71.89,25.15 v71.93,25.11 71.9,25.14 v69.17,25.14 | v71.91,29.01 70.64,29.01 J4.12 70.44,28.81 v69.19,28.81 69.04,28.81 | J4.16 70.08,32 v69.86,32 | J4.14 70.57,30.23 v70.24,29.9 | J4.10 69.08,27.69 69.06,27.71 v69.09,27.71 | J4.8 69.14,26.42 v69.09,26.47 | v69.3,24.21 | J4.2 69.71,22.61 v69.3,22.19
  other vias: 64.34,20.82 63.73,32.77
  pour Route2 (no thermals): 74.37,34.38 74.37,19.25 62.83,19.25 62.67,34.41
  pour Bottom (no thermals): 74.32,34.39 74.32,19.26 62.78,19.26 62.62,34.42
  pour Top (no thermals): 74.27,34.39 74.27,19.26 62.74,19.26 62.58,34.42
  pour Route15 (no thermals): 74.28,34.42 74.28,19.28 62.74,19.28 62.58,34.44
INA_M1  (via drill 0.35)
  Top 0.2: R19.1 29.08,26.17 26.78,28.46 v26.18,28.46
  Top 0.4: v7.06,29.52 7.13,29.59 J5.26
  Bottom 0.2: v26.18,28.46 22.92,28.46 21.79,29.59 J3.26
  Bottom 0.4: J3.26 8.16,29.52 v7.06,29.52
INA_M2  (via drill 0.35)
  Top 0.2: R7.1 27.61,50.88 20.73,50.88 16.64,46.8 16.64,29.15 14.55,27.05 8.55,27.05 J5.22
  Top 0.4: v6.96,27.11 7.02,27.05 8.55,27.05
  Bottom 0.4: J3.22 7.02,27.05 v6.96,27.11
INB_M1  (via drill 0.35)
  Top 0.2: R20.1 28.37,3.71 27,2.35 18.25,2.35 15.71,4.89 15.71,15.63 21.82,21.74 21.82,26.53 v21.13,27.21
  Top 0.4: J5.24 7.96,28.25 v7.06,28.25
  Bottom 0.2: v21.13,27.21 20.02,28.32 J3.24
  Bottom 0.4: v7.06,28.25 8.15,28.25 J3.24
INB_M2  (via drill 0.35)
  Top 0.2: R8.1 27.64,31.49 24.5,31.49 22.9,29.89 22.9,26.59 22.85,26.54 v22.85,26.5
  Top 0.4: J5.20 8.02,25.76 6.97,25.76 v6.96,25.77
  Bottom 0.2: v22.85,26.5 22.14,25.78 J3.20
  Bottom 0.4: v6.96,25.77 v6.97,25.78 J3.20
JACK  (via drill 0.35)
  Top 0.305: v6.95,30.85 9.81,30.85 9.86,30.89 v9.86,30.91
  Top 0.4: J5.28 6.97,30.86 v6.95,30.85
  Bottom 0.305: v9.86,30.91 9.8,30.85 8.21,30.85
  Bottom 0.4: 8.21,30.85 J3.28
MONITORING_ALIM_APU  (via drill 0.35)
  Top 0.4: J2.13 65.25,30.23 v65.24,30.23 67.46,30.23 v67.8,29.89
  Bottom 0.4: J4.13 v65.24,30.23 67.46,30.23 v67.8,29.89
MONITORING_ALIM_MOTOR  (via drill 0.35)
  Top 0.305: v7.08,34.66 9.85,34.66 v9.92,34.73
  Top 0.4: v7.08,34.66 7.09,34.67 J5.34
  Bottom 0.305: J3.34 9.86,34.67 v9.92,34.73
  Bottom 0.4: J3.34 8.2,34.64 7.08,34.64 v7.08,34.66
MONITORING_ALIM_SEQ  (via drill 0.35)
  Top 0.305: J5.36 8.05,35.95 v9.79,35.95
  Bottom 0.305: v9.79,35.95 9.77,35.93 v7.05,35.93
  Bottom 0.4: v7.05,35.93 8.22,35.93 J3.36
N$23
  Top 0.2: U1.8 27.03,40.08 R12.2 R1.2
N$24
  Top 0.2: R10.2 25.57,47.7 25.57,45.73 26.53,44.76 R3.1 28.91,43.08 U1.5
N$25
  Top 0.2: U1.9 28.81,39.08 R4.1 26.86,37.74 25.96,36.84 R11.2
N$26
  Top 0.2: U1.7 27.39,41.08 R2.1 23.77,44.67 R9.2
N$27
  Top 0.2: U1.10 30.56,38.08 R5.2 29.5,37.76 28.83,37.09 28.83,34.6 R8.2
N$28
  Top 0.2: U1.4 31.04,44.08 R6.2 29.51,44.76 28.77,45.5 R7.2
N$29
  Top 0.2: U2.8 25.72,11.59 R24.2 21.32,8.9 R13.2
N$30
  Top 0.2: U2.5 28.67,14.59 R15.1 27.49,15.76 26.57,15.76 26.01,16.32 R22.2
N$31
  Top 0.2: U2.9 28.19,10.59 R16.1 25.67,9.08 24.91,8.32 R23.2
N$32
  Top 0.2: U2.7 27.63,12.59 R14.1 22.37,15.66 R21.2
N$33
  Top 0.2: U2.10 30.54,9.59 R17.2 29.15,9.13 28.37,8.34 R20.2
N$34
  Top 0.2: U2.4 32.83,15.56 R18.2 29.45,15.56 29.08,15.93 R19.2
OUTA_M1  (via drill 0.35)
  Top 0.813: v54.83,21.41 54.83,20.34 | 54.83,20.34 53.06,18.57 53.05,18.59 U2.30 v47.84,18.59 U2.HS2 | 54.83,20.34 54.44,20.34 53.76,21.01 v53.76,22.18 | U2.HS2 47.17,13.59 U2.25 | U2.HS2 42.17,18.59 U2.1
  Bottom 0.813: v54.83,21.41 54.83,23.24 | v53.76,22.18 54.83,23.24 | 54.83,23.24 J1.2 54.83,20.39 53,18.56 47.9,18.56 47.88,18.59 v47.84,18.59
OUTA_M2  (via drill 0.35)
  Top 0.4: U1.HS2 44.89,43.09 44.89,42.88 45.69,42.08 v47.61,42.08 47.05,42.08 U1.HS2
  Top 0.813: 56.11,30.88 56.11,39.3 53.33,42.08 U1.25 v47.61,42.08 46.54,42.08 | 56.11,30.88 v56.11,29.43 | 56.11,30.88 57.27,29.72 v57.27,29.45 | 44.79,45.55 44.79,46.31 45.56,47.08 U1.30 v51.96,47.08 | 44.79,45.55 44.79,42.99 44.89,43.09 | U1.1 43.27,47.08 44.79,45.55
  Bottom 0.813: v56.11,29.43 J1.3 | J1.3 56.1,39.27 56.11,39.27 | v57.27,29.45 57.27,28.54 56.17,27.44 J1.3 | 56.11,39.27 | v47.61,42.08 47.61,42.1 53.28,42.1 56.11,39.27
OUTB_M1  (via drill 0.35)
  Top 0.813: 56.12,19.69 56.12,12.31 53.39,9.59 U2.21 47.17,9.59 U2.HS3 | 56.12,19.69 v56.12,21.36 | 56.12,19.69 57.4,20.97 v57.4,22.17 | U2.HS3 47.84,4.58 U2.16 52.05,4.58 52.08,4.62 52.12,4.62 v52.19,4.55 | U2.HS3 42.17,4.58 U2.15
  Bottom 0.813: v56.12,21.36 56.12,23.35 | 56.12,23.35 J1.4 56.1,12.36 53.32,9.58 v47.97,9.58 | v57.4,22.17 57.3,22.17 56.12,23.35
OUTB_M2  (via drill 0.35)
  Top 0.4: U1.HS3 44.89,35.16 | 47.88,38.08 45.44,35.64 45.44,35.37
  Top 0.813: 53.64,30.37 U1.16 v47.72,33.08 45.44,35.37 U1.HS3 | 53.64,30.37 54.7,29.32 v54.74,29.32 | 53.64,30.37 53.64,29.64 v53.61,29.6 | U1.21 47.88,38.08 46.39,38.08 46.56,37.9 | U1.15 44.18,33.08 44.89,33.79 44.89,35.16
  Bottom 0.813: v54.74,29.32 54.83,29.23 J1.1 | v53.61,29.6 53.61,28.66 J1.1 | J1.1 54.83,29.1 50.81,33.12 47.58,33.12 47.62,33.08 v47.72,33.08
PWM_M1  (via drill 0.35)
  Top 0.2: R21.1 22.81,17.82 22.81,24.15 24.41,25.75 24.41,29.25 v24.3,29.35
  Top 0.4: v6.97,32.09 7.99,32.09 J5.30
  Bottom 0.2: J3.30 21.53,32.13 v24.3,29.36 v24.3,29.35
  Bottom 0.4: J3.30 8.18,32.09 v6.97,32.09
PWM_M2  (via drill 0.35)
  Top 0.2: R9.1 19.93,46.38 v18.72,45.16 | v18.72,45.16
  Top 0.4: J5.32 6.97,33.4 v6.9,33.34
  Bottom 0.2: J3.32 11.77,33.4 13.23,34.85 13.23,39.67 v18.72,45.16
  Bottom 0.4: v6.9,33.34 6.97,33.4 J3.32
RX_APU  (via drill 0.35)
  Top 0.4: J2.11 66.66,28.91 v65.16,28.91 68.06,28.91 68.08,28.89 v68.08,28.78
  Bottom 0.4: J4.11 66.45,28.89 | 65.16,28.89 66.45,28.89 | v68.08,28.78 67.97,28.89 66.45,28.89
SCL_SEQ  (via drill 0.35)
  Top 0.305: v9.79,37.22 7.13,37.22 v7.09,37.25
  Top 0.4: v7.09,37.25 8,37.25 J5.38
  Bottom 0.305: J3.38 v9.79,37.21 | v9.79,37.21 | v9.79,37.21 v9.79,37.22
SDA_SEQ  (via drill 0.35)
  Top 0.305: J5.40 8.05,38.47 v9.59,38.47
  Bottom 0.305: v9.59,38.47 7.02,38.47 v6.97,38.52
  Bottom 0.4: v6.97,38.52 8.19,38.52 J3.40
TX_APU  (via drill 0.35)
  Top 0.4: J2.9 65.27,27.69 v65.26,27.7 67.89,27.7 v67.98,27.62
  Bottom 0.4: J4.9 v65.26,27.7 65.33,27.62 v67.98,27.62